# EAGLE design main (EAGLE 7.7.0)
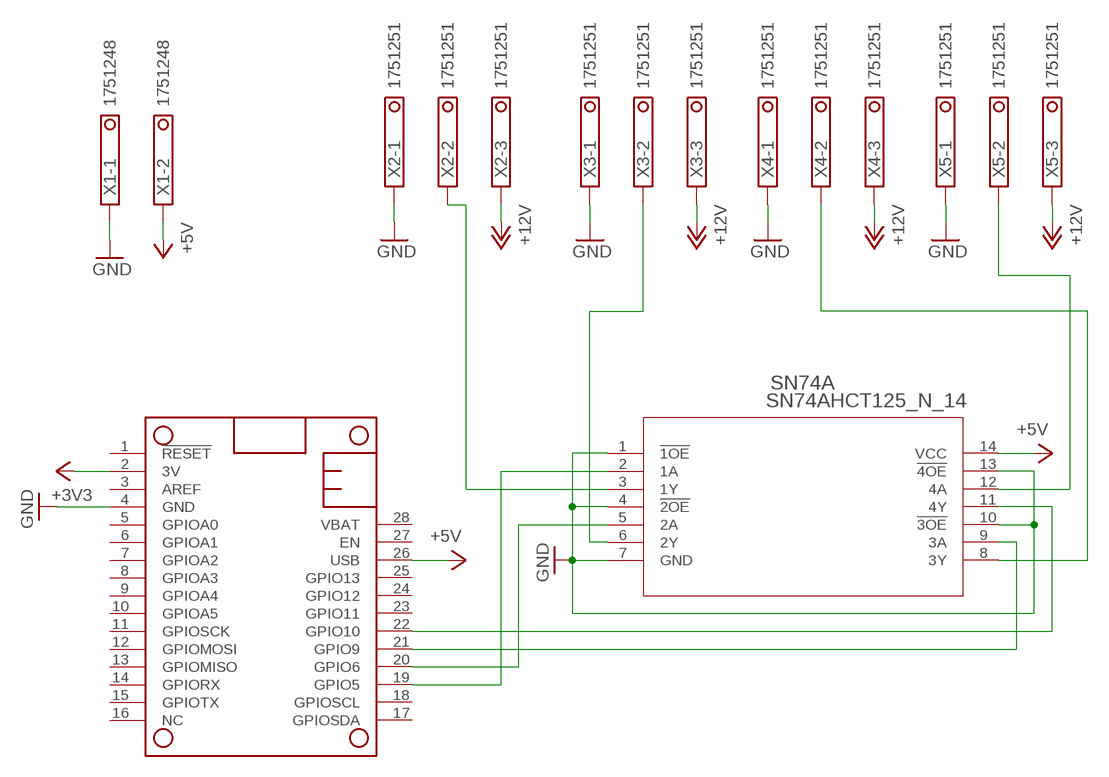
[diagram p0: schematic, sheet 1]

## Parts
MS1  FEATHERWING_NODIM  [FEATHERWING_DIM]
SN74A  SN74AHCT125_N_14  [N14]
X1  1751248  [1751248]
X2  1751251  [1751251]
X3  1751251  [1751251]
X4  1751251  [1751251]
X5  1751251  [1751251]

## Nets
+3V3: MS1.2(3V)
+5V: MS1.26(USB) SN74A.14(VCC) X1.2
+12V: X2.3 X3.3 X4.3 X5.3
GND: MS1.4(GND) SN74A.1(!1OE) SN74A.4(!2OE) SN74A.7(GND) SN74A.10(!3OE) SN74A.13(!4OE) X1.1 X2.1 X3.1 X4.1 X5.1
HDATA1: SN74A.3(1Y) X2.2
HDATA2: SN74A.6(2Y) X3.2
HDATA3: SN74A.8(3Y) X4.2
HDATA4: SN74A.12(4A) X5.2
LDATA1: MS1.19(GPIO5) SN74A.2(1A)
LDATA2: MS1.20(GPIO6) SN74A.5(2A)
LDATA3: MS1.21(GPIO9) SN74A.9(3A)
LDATA4: MS1.22(GPIO10) SN74A.11(4Y)
Unconnected: MS1.1(!RESET) MS1.3(AREF) MS1.5(GPIOA0) MS1.6(GPIOA1) MS1.7(GPIOA2) MS1.8(GPIOA3) MS1.9(GPIOA4) MS1.10(GPIOA5) MS1.11(GPIOSCK) MS1.12(GPIOMOSI) MS1.13(GPIOMISO) MS1.14(GPIORX) MS1.15(GPIOTX) MS1.16(NC) MS1.17(GPIOSDA) MS1.18(GPIOSCL) MS1.23(GPIO11) MS1.24(GPIO12) MS1.25(GPIO13) MS1.27(EN) MS1.28(VBAT)

## Library data of the parts
MS1 = adafruit:FEATHERWING
SN74A = SN74AHCT125N:SN74AHCT125_N_14; MANUFACTURER_PART_NUMBER: sn74ahct125_n_14; VENDOR: Texas Instruments
X1 = con-phoenix-350:1751248: MKDS 1/ 2-3,5 Printklemme Nennstrom: 10 A Bemessungsspannung: 160 V Raster: 3,5 mm Polzahl: 2 Montageart: Löten Anschlussart: Schraubanschluss Anschlussrichtung vom Leiter zur Platine: 0° Source: http://eshop.phoenixcontact.com .. 1751248.pdf; OC_FARNELL: unknown; OC_NEWARK: unknown
X2-X5 = con-phoenix-350:1751251: MKDS 1/ 3-3,5 Printklemme Nennstrom: 10 A Bemessungsspannung: 160 V Raster: 3,5 mm Polzahl: 3 Montageart: Löten Anschlussart: Schraubanschluss Anschlussrichtung vom Leiter zur Platine: 0° Source: http://eshop.phoenixcontact.com .. 1751251.pdf; OC_FARNELL: unknown; OC_NEWARK: unknown

## Net classes
0 default: width 0.762 mm, clearance 0.305 mm

## Board
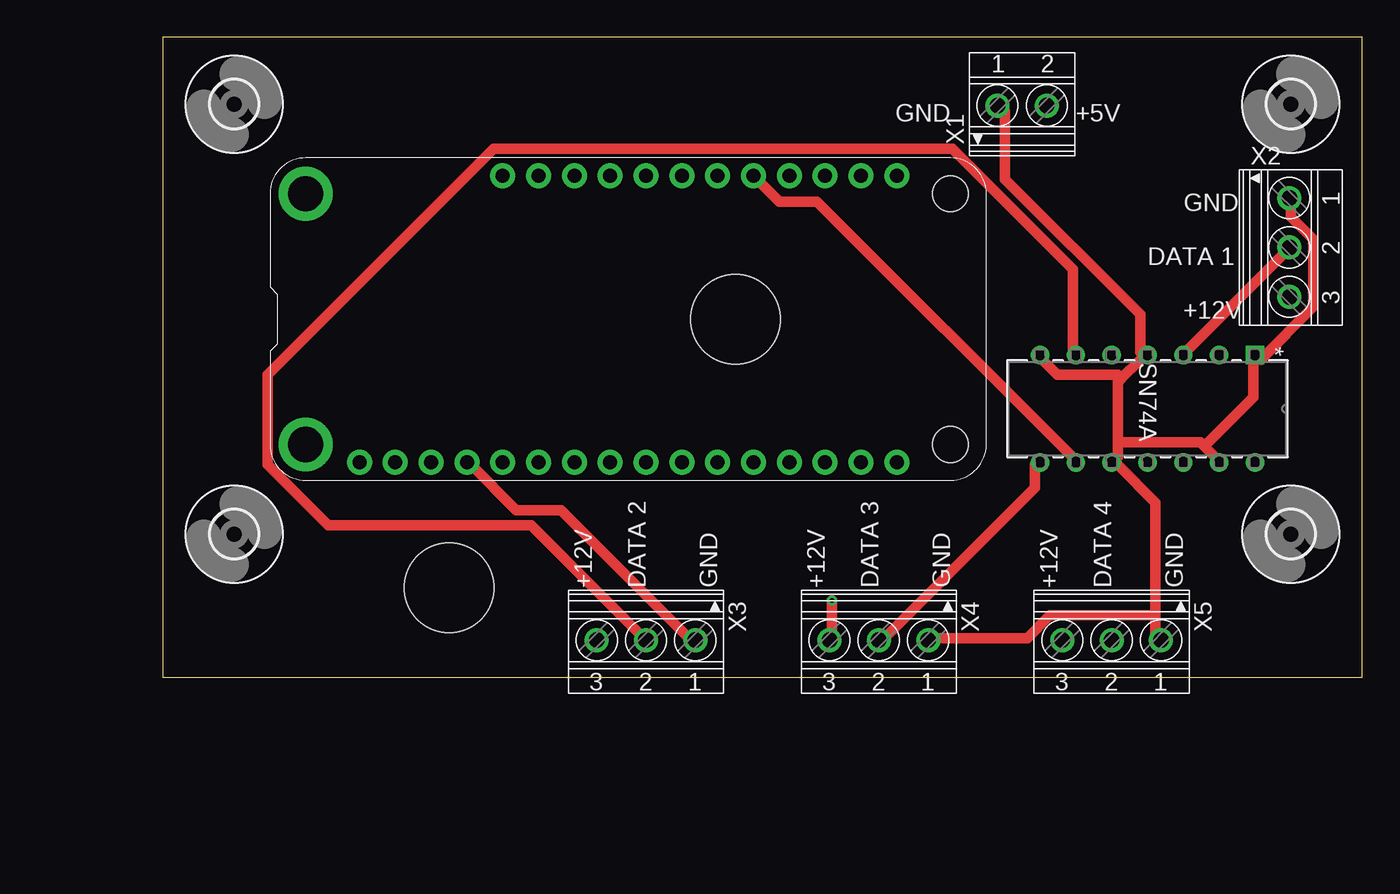
[diagram p1: board, top side]
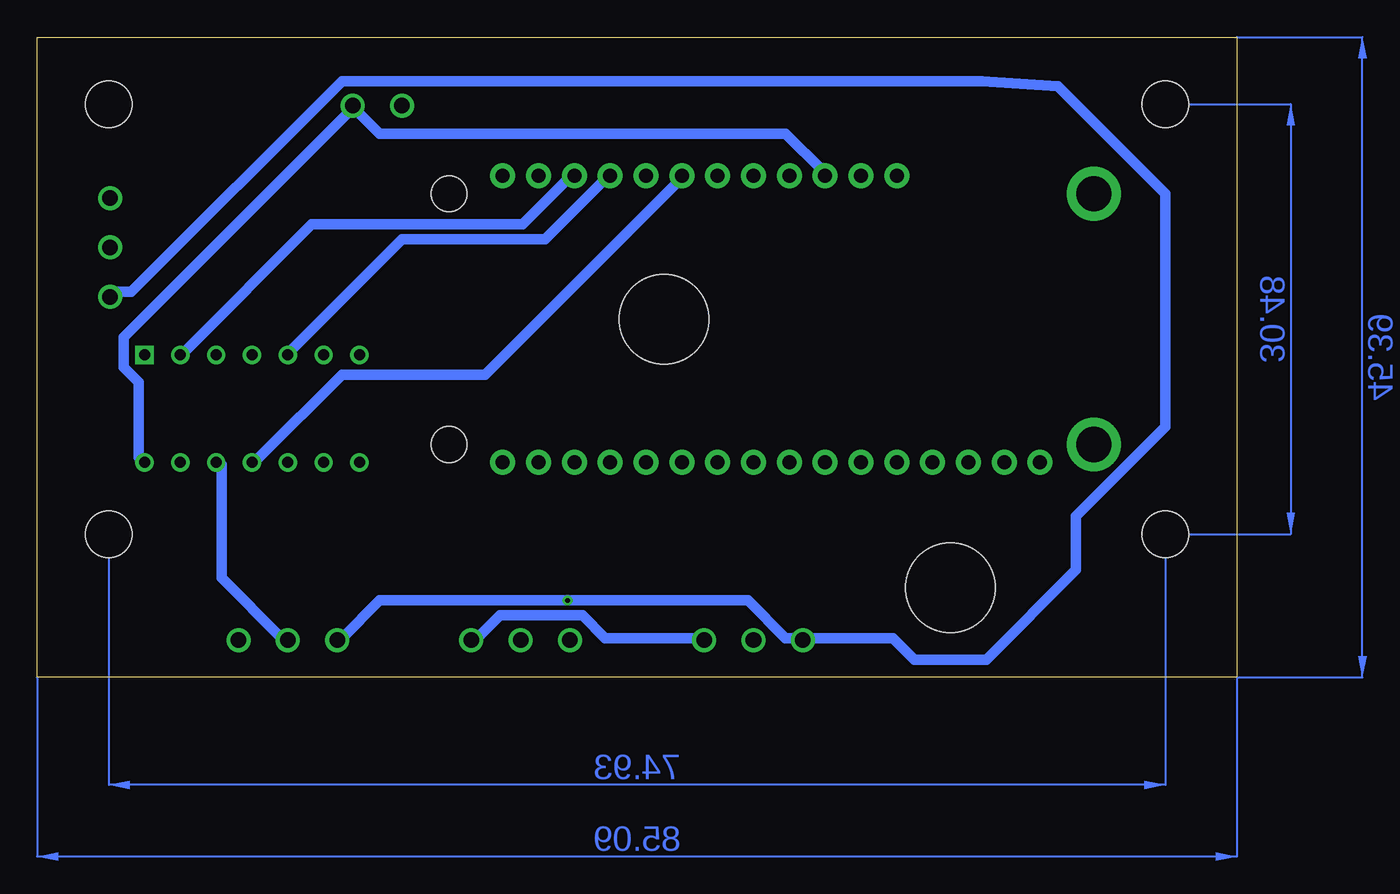
[diagram p2: board, bottom side, seen from below]

Size 85.09 x 45.39 mm. Coordinates in mm from the lower left corner, seen from the top.
Outline: 0,0 85.09,0 85.07,45.39 0,45.39 0,0
Copper layers (1*16): Top 0.0356mm / dielectric 1.5011mm / Bottom 0.0356mm
Design rules "oshpark-2layer": minimum track width 6mil, minimum drill 13mil, track to track 6mil, track to pad 6mil, pad to pad 6mil, via to via 6mil, smd to smd 6mil, copper to edge 15mil, drill to drill 6mil, minimum pad ring 7mil, minimum via ring 7mil, stop-mask expansion 2.5mil, vias tented up to drill 0mil, thermal gap 10mil
Holes 6.35 mm at 40.64,25.4 20.32,6.35

### Footprints (pad centres in the part's own frame; a part is rotated, then mirrored left to right if it is on the bottom)
FEATHERWING_DIM = drill 1 pad 1.778: 1 6.35,1.27; 2 8.89,1.27; 3 11.43,1.27; 4 13.97,1.27; 5 16.51,1.27; 6 19.05,1.27; 7 21.59,1.27; 8 24.13,1.27; 9 26.67,1.27; 10 29.21,1.27; 11 31.75,1.27; 12 34.29,1.27; 13 36.83,1.27; 14 39.37,1.27; 15 41.91,1.27; 16 44.45,1.27; 17 44.45,21.59; 18 41.91,21.59; 19 39.37,21.59; 20 36.83,21.59; 21 34.29,21.59; 22 31.75,21.59; 23 29.21,21.59; 24 26.67,21.59; 25 24.13,21.59; 26 21.59,21.59; 27 19.05,21.59; 28 16.51,21.59 | drill 2.5 pad 3.81: P$1 2.54,20.32; P$2 2.54,2.54 | hole 2.54: 48.26,20.32; 48.26,2.54
N14 = drill 0.787 pad 1.295 square: 1 -7.62,15.24 | drill 0.787 pad 1.295: 2 -7.62,12.7; 3 -7.62,10.16; 4 -7.62,7.62; 5 -7.62,5.08; 6 -7.62,2.54; 7 -7.62,0; 8 0,0; 9 0,2.54; 10 0,5.08; 11 0,7.62; 12 0,10.16; 13 0,12.7; 14 0,15.24
3,3 = hole 3.3: 0,0
1751248 = drill 1.1 pad 1.7: 1 -1.75,-0.1; 2 1.75,-0.1
1751251 = drill 1.1 pad 1.7: 1 -3.5,-0.1; 2 0,-0.1; 3 3.5,-0.1

### Placement (x,y rotation side)
MS1  7.62,13.97 0 top
SN74A  62.23,15.24 270 top
U$2  [3,3]  5.08,40.64 0 top
U$3  [3,3]  5.08,10.16 0 top
U$4  [3,3]  80.01,10.16 0 top
U$5  [3,3]  80.01,40.64 0 top
X1  60.96,40.64 0 top
X2  80.01,30.48 270 top
X3  34.29,2.54 180 top
X4  50.8,2.54 180 top
X5  67.31,2.54 180 top

### Tracks (layer width: path | path; a pad name or v marks a point on that pad's centre or on a via)
+5V
  Bottom 0.762: SN74A.14 77.88,15.6 77.88,20.93 78.94,22 78.94,24.13 62.94,40.13 X1.2 62.41,40.13 60.81,38.53 32,38.53 29.34,35.87 MS1.26
+12V  (via drill 0.33)
  Top 0.762: v47.47,5.46 47.47,2.79 X4.3
  Bottom 0.762: X5.3 63.48,2.79 60.81,5.46 v47.47,5.46 34.67,5.46 32,2.79 30.94,2.79 X3.3 30.4,2.79 24.38,2.79 22.86,1.27 17.78,1.27 11.43,7.62 11.43,11.43 5.08,17.78 5.08,34.29 12.7,41.91 18.11,42.27 63.48,42.27 78.41,27.33 79.48,27.33 X2.3
GND
  Top 0.762: MS1.4 21.87,15.06 25.07,11.86 28.27,11.86 37.34,2.79 X3.1 | 67.74,16.66 67.74,20.93 68.01,21.2 | 67.74,16.66 67.74,15.6 SN74A.10 67.74,15.06 70.41,12.4 70.41,4.39 | 68.01,21.2 69.34,22.53 SN74A.4 69.34,23.06 69.34,25.73 59.74,35.33 59.74,40.13 X1.1 | SN74A.7 62.41,22.53 63.48,21.46 67.74,21.46 68.01,21.2 | 73.88,16.4 73.61,16.66 67.74,16.66 | 73.88,16.4 74.68,15.6 SN74A.13 | 73.88,16.4 77.34,19.86 77.34,22.53 SN74A.1 77.88,22.53 81.61,26.26 81.61,31.06 80.01,32.66 80.01,33.73 X2.1 | 70.41,4.39 70.41,2.79 X5.1 | 70.41,4.39 62.94,4.39 61.34,2.79 54.41,2.79 X4.1
  Bottom 0.762: X3.1 37.87,2.79 44.81,2.79 46.41,4.39 52.27,4.39 53.87,2.79 X4.1
HDATA1
  Top 0.762: SN74A.3 72.54,23.06 79.48,30 X2.2
HDATA2
  Top 0.762: SN74A.6 64.54,23.06 64.54,28.93 56.01,37.46 23.47,37.46 7.47,21.46 7.47,15.06 11.73,10.79 26.14,10.79 34.14,2.79 X3.2
HDATA3
  Top 0.762: SN74A.8 61.87,15.06 61.87,13.46 51.21,2.79 X4.2
HDATA4
  Bottom 0.762: SN74A.12 72.01,15.06 72.01,7.06 67.74,2.79 X5.2
LDATA1
  Bottom 0.762: SN74A.2 74.68,23.06 65.61,32.13 50.67,32.13 47.47,35.33 MS1.19
LDATA2
  Bottom 0.762: SN74A.5 67.21,23.06 59.21,31.06 49.07,31.06 44.81,35.33 MS1.20
LDATA3
  Top 0.762: MS1.21 43.74,33.73 46.41,33.73 64.54,15.6 SN74A.9
LDATA4
  Bottom 0.762: SN74A.11 69.34,15.6 63.48,21.46 53.34,21.46 39.47,35.33 MS1.22
(copper drawn outside any net)
  shapes: Bottom area x4

### Text on the board
_tsilk: GND | +5V | GND | DATA 1 | +12V | +12V | DATA 2 | GND | +12V | DATA 3 | GND | +12V | DATA 4 | GND